# EAGLE schematic cadiz_mb_20131224 (EAGLE 6.1)
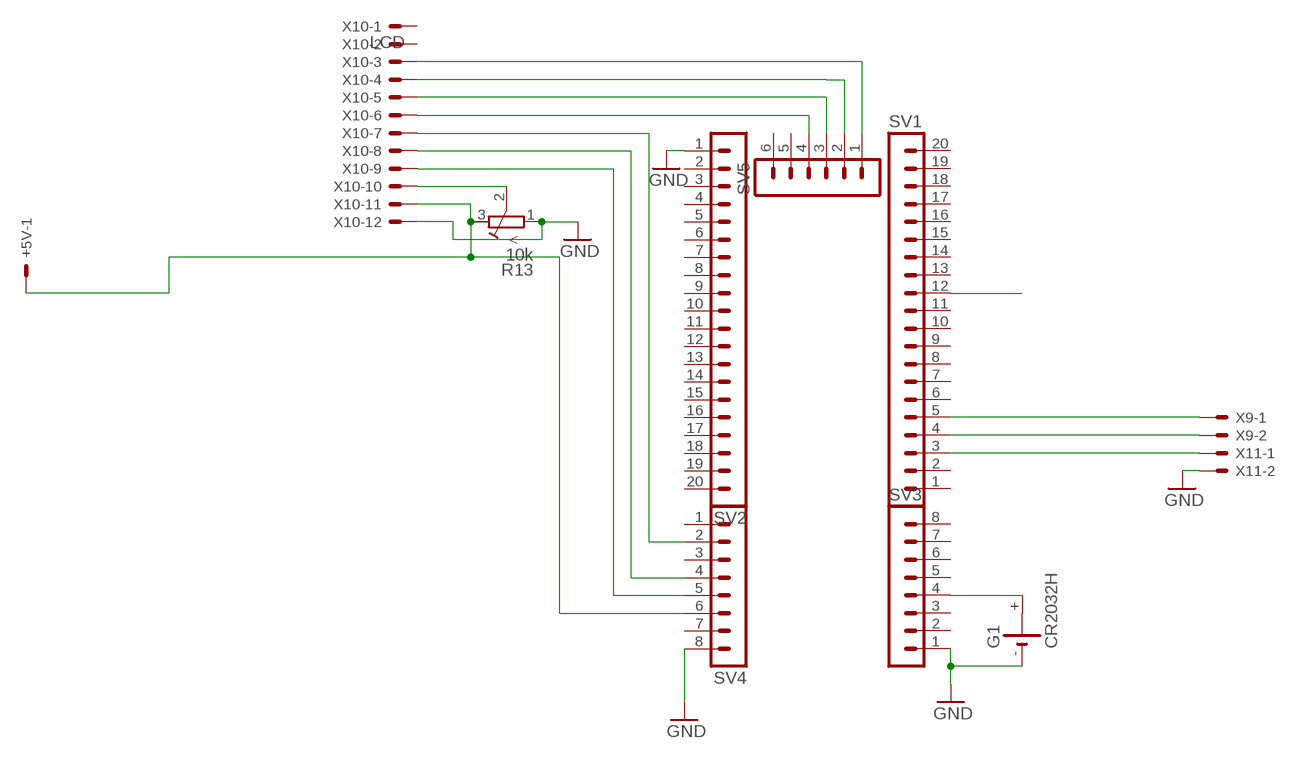
[diagram p0: schematic, sheet 1]

## Parts
+5V  22-23-2021  [22-23-2021]
G1  CR2032H  [CR2032H]
R13  10k  R-TRIMM3374  [RTRIM3374]
SV1  MA20-1  [MA20-1]
SV2  MA20-1  [MA20-1]
SV3  MA08-1  [MA08-1]
SV4  MA08-1  [MA08-1]
SV5  MA06-1  [MA06-1]
X9  22-23-2021  [22-23-2021]
X10  LCD  22-23-2121  [22-23-2121]
X11  22-23-2021  [22-23-2021]

## Nets
GND [1A]: G1.- R13.1(E) SV2.1 SV3.1 SV4.8 X10.12 X11.2
N$1: SV1.12
N$4: SV5.4 X10.6
N$6: G1.+ SV3.4
N$10: SV1.3 X11.1
N$13: SV1.4 X9.2
N$14: SV1.5 X9.1
N$20: SV4.2 X10.7
N$23: SV4.4 X10.8
N$30: SV4.5 X10.9
N$31: SV5.1 X10.3
N$32: SV5.2 X10.4
N$33: SV5.3 X10.5
N$35: R13.2(S) X10.10
N$36 [1A]: +5V.1 R13.3(A) SV4.6 X10.11
Unconnected: +5V.2 G1.+@1(+) SV1.1 SV1.2 SV1.6 SV1.7 SV1.8 SV1.9 SV1.10 SV1.11 SV1.13 SV1.14 SV1.15 SV1.16 SV1.17 SV1.18 SV1.19 SV1.20 SV2.2 SV2.3 SV2.4 SV2.5 SV2.6 SV2.7 SV2.8 SV2.9 SV2.10 SV2.11 SV2.12 SV2.13 SV2.14 SV2.15 SV2.16 SV2.17 SV2.18 SV2.19 SV2.20 SV3.2 SV3.3 SV3.5 SV3.6 SV3.7 SV3.8 SV4.1 SV4.3 SV4.7 SV5.5 SV5.6 X10.1 X10.2

## Library data of the parts
+5V X9 X11 = con-molex:22-23-2021: .100" (2.54mm) Center Header - 2 Pin; MF: MOLEX; MPN: 22-23-2021; OC_FARNELL: 1462926; OC_NEWARK: 25C3832
G1 = battery:CR2032H: LI BATTERY Varta
R13 = resistor:R-TRIMM: Trimm resistor
SV1 SV2 = con-lstb:MA20-1: PIN HEADER; OC_FARNELL: unknown; OC_NEWARK: unknown
SV3 SV4 = con-lstb:MA08-1: PIN HEADER; OC_FARNELL: unknown; OC_NEWARK: unknown
SV5 = con-lstb:MA06-1: PIN HEADER; OC_FARNELL: unknown; OC_NEWARK: unknown
X10 = con-molex:22-23-2121: .100" (2.54mm) Center Header - 12 Pin; MF: MOLEX; MPN: 22-23-2121; OC_FARNELL: 1462935; OC_NEWARK: 56H0456